# EAGLE schematic tugas 1 schematic (EAGLE 9.6.2)
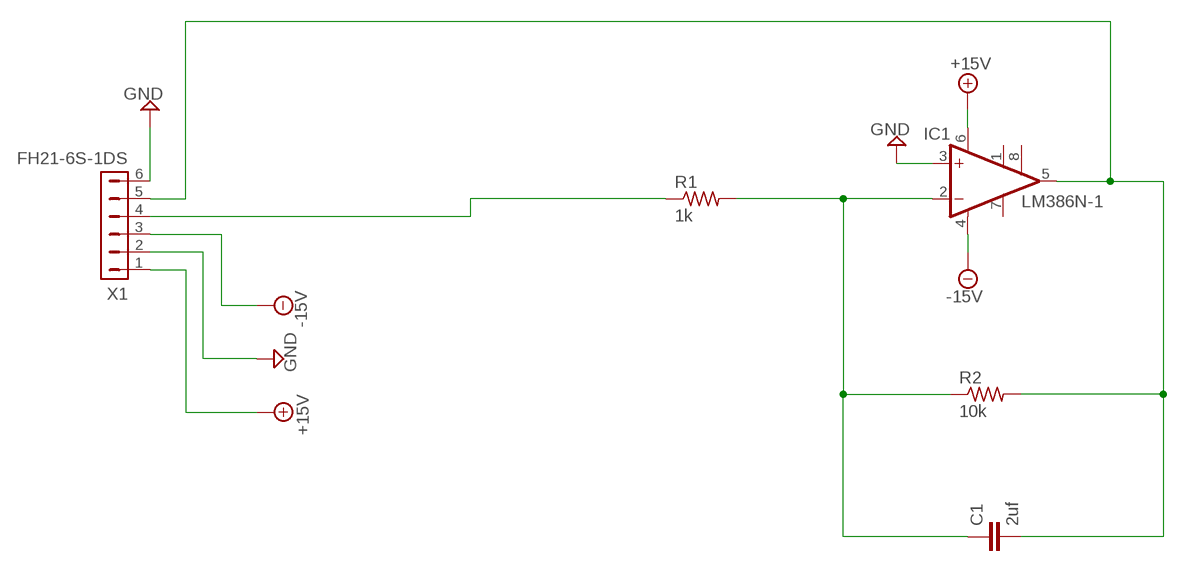
[diagram p0: schematic, sheet 1]

## Parts
C1  2uf  C-EUC0603  [C0603]
IC1  LM386N-1  [DIL08]
R1  1k  R-US_R0603  [R0603]
R2  10k  R-US_R0603  [R0603]
X1  FH21-6S-1DS  [FH21-6S-1DS]

## Nets
+15V: IC1.6(VS) X1.1
-15V: IC1.4(GND) X1.3
GND: IC1.3(+IN) X1.2 X1.6
N$1: C1.1 IC1.2(-IN) R1.2 R2.1
N$2: R1.1 X1.4
N$3: C1.2 IC1.5(OUT) R2.2 X1.5
Unconnected: IC1.1(GAIN) IC1.7(BYPASS) IC1.8(GAIN)

## Library data of the parts
C1 = rcl:C-EU: CAPACITOR, European symbol; SPICEPREFIX: C
IC1 = linear:LM386?-*: Low Voltage Audio Power Amplifier Source: http://cache.national.com/ds/LM/LM386.pdf
R1 R2 = rcl:R-US_: RESISTOR, American symbol; SPICEPREFIX: R
X1 = con-hirose:FH21-6S-1DS: FPC CONNECTOR Source: con-hirose.lbr from Bob Starr <rtzaudio@mindspring.com>; OC_FARNELL: unknown; OC_NEWARK: unknown